# Altium schematic sheet Sensors.SchDoc
size A; SheetNumber: 3; SheetTotal: 7
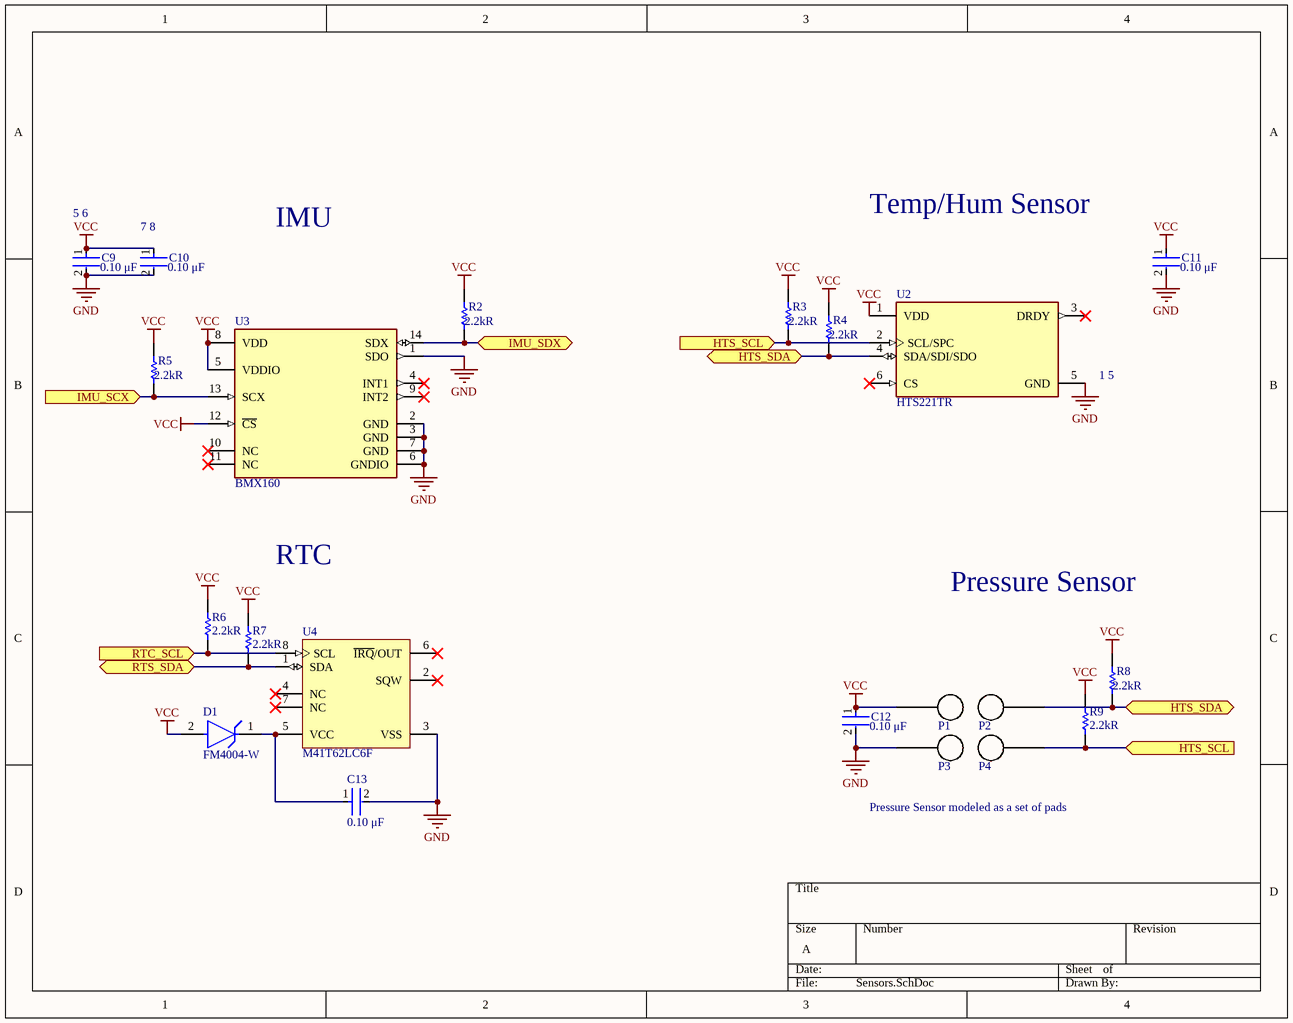
[diagram p0: Sensors.SchDoc]

## Parts
C9  Capacitance: 0.10 μF  [FP-C0603C-CF-MFG]  (hidden comment: C0603C104K5RACTU)
C10  Capacitance: 0.10 μF  [FP-C0603C-CF-MFG]  (hidden comment: C0603C104K5RACTU)
C11  Capacitance: 0.10 μF  [FP-C0603C-CF-MFG]  (hidden comment: C0603C104K5RACTU)
C12  Capacitance: 0.10 μF  [FP-C0603C-CF-MFG]  (hidden comment: C0603C104K5RACTU)
C13  Capacitance: 0.10 μF  [FP-C0603C-CF-MFG]  (hidden comment: C0603C104K5RACTU)
D1  FM4004-W  [FP-SMA-MFG]
P1  BlankPad  [BlankPad]  (value not drawn)
P2  BlankPad  [BlankPad]  (value not drawn)
P3  BlankPad  [BlankPad]  (value not drawn)
P4  BlankPad  [BlankPad]  (value not drawn)
R2  Resistance: 2.2kR  [RESC2013X60X40LL20T25]  (hidden comment: ERA6AEB222V)
R3  Resistance: 2.2kR  [RESC2013X60X40LL20T25]  (hidden comment: ERA6AEB222V)
R4  Resistance: 2.2kR  [RESC2013X60X40LL20T25]  (hidden comment: ERA6AEB222V)
R5  Resistance: 2.2kR  [RESC2013X60X40LL20T25]  (hidden comment: ERA6AEB222V)
R6  Resistance: 2.2kR  [RESC2013X60X40LL20T25]  (hidden comment: ERA6AEB222V)
R7  Resistance: 2.2kR  [RESC2013X60X40LL20T25]  (hidden comment: ERA6AEB222V)
R8  Resistance: 2.2kR  [RESC2013X60X40LL20T25]  (hidden comment: ERA6AEB222V)
R9  Resistance: 2.2kR  [RESC2013X60X40LL20T25]  (hidden comment: ERA6AEB222V)
U2  HTS221TR  [FP-HTS221TR-MFG]
U3  BMX160  [FP-BMX160-MFG]
U4  M41T62LC6F  [STM-LCC8_V]

## Ports
HTS_SCL (in), HTS_SDA (bidir), IMU_SCX (in), IMU_SDX (bidir), RTC_SCL (in), RTS_SDA (bidir)

## Nets
GND: C9.2 C10.2 C11.2 C12.2 C13.2 U2.5(GND) U3.1(SDO) U3.2(GND) U3.3(GND) U3.6(GNDIO) U3.7(GND) U4.3(VSS)
VCC: C9.1 C10.1 C11.1 C12.1 D1.2(A) R2.2 R3.2 R4.2 R5.2 R6.2 R7.2 R8.2 R9.2 U2.1(VDD) U3.5(VDDIO) U3.8(VDD) U3.12(~{CS})
HTS_SCL: R3.1 R9.1 U2.2(SCL/SPC) ; port HTS_SCL
HTS_SDA: R4.1 R8.1 U2.4(SDA/SDI/SDO) ; port HTS_SDA
IMU_SCX: R5.1 U3.13(SCX) ; port IMU_SCX
IMU_SDX: R2.1 U3.14(SDX) ; port IMU_SDX
RTC_SCL: R6.1 U4.8(SCL) ; port RTC_SCL
RTS_SDA: R7.1 U4.1(SDA) ; port RTS_SDA
NetC13_1: C13.1 D1.1(K) U4.5(VCC)

Not connected (* = marked no-connect by the designer): P1 0; P2 0; P3 0; P4 0; U2 3(DRDY)* 6(CS)*; U3 4(INT1)* 9(INT2)* 10(NC)* 11(NC)*; U4 2(SQW)* 4(NC)* 6(~{IRQ}/OUT)* 7(NC)*

## Notes on the sheet
- (near C9) 5 6
- (near C10) 7 8
- IMU
- Temp/Hum Sensor
- (near U2) 1 5
- RTC
- Pressure Sensor
- Pressure Sensor modeled as a set of pads

## Library data of the parts
C9-C13 = CMP-2006-03061-2: CAP CER 0.1UF 50V X7R 0603; Manufacturer: KEMET; Tolerance: 0.1; Temperature Coefficient: 30ppm/°C; Material: Ceramic; Automotive Grade: Grade 1; Value: 0.10 μF; Temperature: -55°C to +125°C; RoHS: TRUE; Temperature Range High: +125°C; Lead Free: Yes; Octopart: https://octopart.com/c0603c104k5ractu-kemet-139244; Digikey Description: CAP CER 0.1UF 50V X7R 0603; Category: Cap; Package: C0603C-CF; ComponentLink2Description: Datasheet; Temperature Range Low: -55°C; Device Class L1: Passive Components; Voltage Rating: 50 V; Automotive: Yes; Device Class L3: Ceramic Capacitors; ComponentLink2URL: https://api.kemet.com/component-edge/download/datasheet/C0603C100J5GACAUTO.pdf; Device Class L2: Capacitors; Manufacturer Part Number: C0603C104K5RACTU; Temperature Characteristic: X7R; Height: 0.87mm
D1 = CMP-12225-000048-1: TVS DIODE 5V 13.4V SMA; Manufacturer Part Number: SMAJ5.0A-TR; Manufacturer: STMicroelectronics; Standoff Height: 0.05mm; Max Junction Temp: +150°C; Clamping Voltage: 9.2V; Number Of Channels: 1; Peak Pulse Power: 400W; Peak Pulse Current: 43.5A; Breakdown Voltage: 6.4V; Direction: Unidirectional; ComponentLink2Description: Datasheet; Lead Free: Yes; Package: SMA; Height: 2.65mm; Mouser Description: Transient Voltage Suppressor, TVS, Transil SMAJ Series, Unidirectional, 5 V, DO-214AC, 2, 6.4 V; Reverse Standoff Voltage: 5V; Temperature Range Low: -55°C; Device Class L1: Circuit Protection; RoHS: TRUE; Category: Diode; Automotive: No; ComponentLink2URL: https://www.st.com/resource/en/datasheet/smaj.pdf; Device Class L3: unset; Device Class L2: TVS Diodes; Temperature Range High: +150°C; Octopart: https://octopart.com/smaj5.0a-tr-stmicroelectronics-347063; Digikey Description: TVS DIODE 5V 13.4V SMA; Temperature: -55°C to +150°C
R2-R9 = CMP-2001-00613-1: Manufacturer: Panasonic; Part Number: ERA6AEB222V
U2 = CMP-2000-06428-2: SENS HUMI/TEMP 2.5V I2C 4.5% SMD; Resolution: 16b; Response Time: 10s; Operating Supply Voltage: 3.6V; Sensor Type: Temperature; Output Type: SPI; Accuracy: 4.5%; Lead Free: Lead Free; Radiation Hardening: No; Packaging: Tape and Reel; Max Operating Temperature: 120°C; Min Operating Temperature: -40°C; Interface: I2C; Mount: Surface Mount; Number of Pins: 6
U3 = CMP-191067-000010-2: IMU ACCEL/GYRO; Output Type: SPI; Sensor Type: Accelerometer; Number of Pins: 14; Max Operating Temperature: 85°C; Min Operating Temperature: -40°C; Case/Package: LGA; Mount: Surface Mount; Packaging: Tape and Reel
U4 = CMP-2000-06643-1: Low-Power Serial Real-Time Clock (RTC) with Alarm, 400 KHz, 1.3 to 4.4 V, -40 to 85 degC, 8-Pin LCC, RoHS, Tape and Reel; Manufacturer: STMicroelectronics; Interface: I²C,2-WireSerial; Current - Timekeeping (Max): 0.7µA~0.95µA@1.3V~4.4V; Other Related Documents: M41T62ViewAllSpecifications; Date Format: YY-MM-DD-dd; Voltage - Supply: 1.3V~4.4V; Online Catalog: SerialAddress; For Use With: 497-16464-ND / -EVALBOARDFORM41T62; Time Format: HH:MM:SS:hh(24hr); Other Names: 497-11275-1; Product Training Modules: SmartGridSolutions:SmartGridDistribution/SmartMeters; Standard Package: 1; Mounting Technology: SurfaceMount; Operating Temperature: -40°C~85°C; Features: Alarm,LeapYear,SquareWaveOutput,WatchdogTimer; Packaging: CutTape(CT); Family: Clock/Timing-RealTimeClocks; Package Description: 8-Pin Leadless Ceramic Chip Carrier, Body 3.2 x 1.5 mm, Pitch 0.9 mm; Mounting Type: SurfaceMount; Series: Timekeeper®; Manufacturer URL: http://www.st.com/; Datasheet URL: http://www.st.com/web/en/resource/technical/document/datasheet/CD00019860.pdf; Package Reference: LCC8; Package / Case: 8-LCC; Type: Clock/Calendar; Category: IntegratedCircuits(ICs); Datasheet Version: Rev. 22, 10/2015; Supplier Device Package: 8-LCC(1.5x3.2)